# Altium schematic sheet RS-485推荐电路.SchDoc
size A4; Author: 李孟雄; DocumentNumber: 7; SheetNumber: 7; SheetTotal: 27; PageSetup: Record=PageOptions|CenterHorizontal=True|CenterVertical=True|PrintScale=1.00|XCorrection=1.00|YCorrection=1.00|PrintKind=0|BorderSize=5000000|LeftOffset=0|BottomOffset=0|Orientation=2|PaperLength=1000|PaperWidth=1000|Scale=100|PaperSource=7|PrintQuality=600|MediaType=1|DitherType=10|PaperKind=A4|PrintScaleMode=1; DesignDate: 2014-01-15; CheckDate: 2014-01-15; SheetName: RS-485; SheetVersion: V1.00; SheetDescription: RSM485H为自动方向切换模块; productName: i.MX6x评估底板; productModel: iMX6x
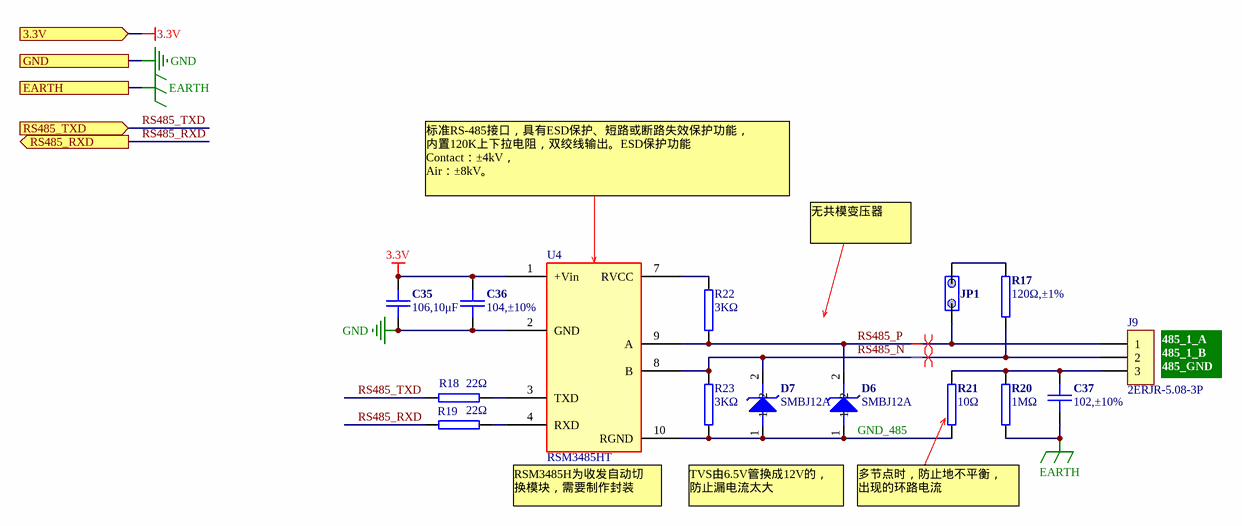
[diagram p0: RS-485推荐电路.SchDoc]

## Parts
C35  106,10μF  [0805C]
C36  104,±10%  [0603C]
C37  102,±10%  [1206C]
D6  value SMBJ12A  [SOD-1812D]  (hidden comment: DIODE ZENER)
D7  value SMBJ12A  [SOD-1812D]  (hidden comment: DIODE ZENER)
J9  value 2ERJR-5.08-3P  [CON-3-5.08]  (hidden comment: CON3)
JP1  120Ω_EN  [SIP-2]  (value not drawn)
R17  120Ω,±1%  [1206R]
R18  22Ω  [0603R]
R19  22Ω  [0603R]
R20  1MΩ  [1206R]
R21  10Ω  [0805R]
R22  3KΩ  [0603R]
R23  3KΩ  [0603R]
U4  RSM3485HT

## Ports
3.3V, EARTH, GND, RS485_RXD (out), RS485_TXD (in)

## Nets
3.3V: C35.1 C36.1 U4.1(+Vin) ; port 3.3V
EARTH: C37.1 R20.2 ; port EARTH
GND: C35.2 C36.2 U4.2(GND) ; port GND
GND_485: D6.1 D7.1 R21.1 R23.2 U4.10(RGND)
RS485_N: D7.2 J9.2 R17.2 R23.1 U4.8(B)
RS485_P: D6.2 J9.1 JP1.1 R22.2 U4.9(A)
RS485_RXD: R19.1 ; port RS485_RXD
RS485_TXD: R18.1 ; port RS485_TXD
NetC37_2: C37.2 J9.3 R20.1 R21.2
NetJP1_2: JP1.2 R17.1
NetR18_2: R18.2 U4.3(TXD)
NetR19_2: R19.2 U4.4(RXD)
NetR22_1: R22.1 U4.7(RVCC)

## Layout directives
differential pair: RS485_N, RS485_P

## Notes on the sheet
- 标准RS-485接口，具有ESD保护、短路或断路失效保护功能，
  内置120K上下拉电阻，双绞线输出。ESD保护功能
  Contact：±4kV，
  Air：±8kV。
- 无共模变压器
- (near J9) 485_1_A
  485_1_B
  485_GND
- (near U4) RSM3485H为收发自动切
  换模块，需要制作封装
- TVS由6.5V管换成12V的，
  防止漏电流太大
- 多节点时，防止地不平衡，
  出现的环路电流
- 1
- #
- 修改日期
- 修改内容
- 2
- 3
- 广州致远电子股份有限公司
- 设计人员
- 审核人员
- 设计日期
- 审核日期
- 产品名称
- 图纸名称
- 产品型号
- 图纸描述
- 图纸版本
- A4

## Library data of the parts
C35 = 1.02.02.0055: 106,10μF,±10%,10V,X5R,0805,RoHS; 名称: 电容; 封装: 0805; 设备封装名称: C0805_106_X5R_10V_10%; 贴片和直插: SMT; 物料代码: 1.02.02.0055; Value: 106,10μF; RoHS: RoHS; 型号: 106,10μF,±10%,10V,X5R; ComponentLink1Description: ErpDataInfo; ComponentLink1URL: http://erp.zlgmcu.com/ErpExt/ErpData/ListMateriel.aspx?pkey=1.02.02.0055
C36 = 1.02.01.0032: 104,±10%,50V,X7R,0603,*,RoHS; 名称: 电容; 封装: 0603; 设备封装名称: C0603_104_X7R_50V_10%; 贴片和直插: SMT; 物料代码: 1.02.01.0032; Value: 104,±10%; RoHS: RoHS; 型号: 104,±10%,50V,X7R; ComponentLink1Description: ErpDataInfo; ComponentLink1URL: http://erp.zlgmcu.com/ErpExt/ErpData/ListMateriel.aspx?pkey=1.02.01.0032
C37 = 1.02.03.0003: 102,±10%,2KV,X7R,1206,*,RoHS; 名称: 电容; 封装: 1206; 设备封装名称: C1206_102_X7R_2KV_10%; 贴片和直插: SMT; 物料代码: 1.02.03.0003; Value: 102,±10%; RoHS: RoHS; 型号: 102,±10%,2KV,X7R; ComponentLink1Description: ErpDataInfo; ComponentLink1URL: http://erp.zlgmcu.com/ErpExt/ErpData/ListMateriel.aspx?pkey=1.02.03.0003
D6 D7 = 1.04.03.0007: SMBJ12A,DO-214AA,君耀,RoHS; 名称: TVS管; 设备封装名称: DO-214AA_SMBJ12A; 贴片和直插: SMT; 器件优选方案: 优先选用; 物料代码: 1.04.03.0007; 封装: DO-214AA; 厂商: 君耀; RoHS: RoHS; 型号: SMBJ12A; ComponentLink1Description: ErpDataInfo; ComponentLink1URL: http://erp.zlgmcu.com/ErpExt/ErpData/ListMateriel.aspx?pkey=1.04.03.0007
J9 = 1.10.06.0170: 2ERJR-5.08-3P; 名称: 端子; 贴片和直插: THT; 器件优选方案: 优先选用; 物料代码: 1.10.06.0170; 型号: 2ERJR-5.08-3P; ComponentLink1Description: ErpDataInfo; ComponentLink1URL: http://erp.zlgmcu.com/ErpExt/ErpData/ListMateriel.aspx?pkey=1.10.06.0170
JP1 = JMP2
R17 = 1.01.03.0025: 名称: 电阻; 规格型号: 120Ω,±1%,1206,RoHS; 封装: 1206; 设备封装名称: R1206_120R_1%; 贴片和直插: SMT; 现有库存: 6550; 物料代码: 1.01.03.0025; Value: 120Ω,±1%; RoHS: RoHS; ComponentLink1Description: ErpDataInfo; ComponentLink1URL: http://erp.zlgmcu.com/ErpExt/ErpData/ListMateriel.aspx?pkey=1.01.03.0025
R18 R19 = 1.01.01.0014: 22Ω,0603,*,RoHS; 名称: 电阻; 封装: 0603; 设备封装名称: R0603_22R; 贴片和直插: SMT; 物料代码: 1.01.01.0014; Value: 22Ω; RoHS: RoHS; 型号: 22Ω; ComponentLink1Description: ErpDataInfo; ComponentLink1URL: http://erp.zlgmcu.com/ErpExt/ErpData/ListMateriel.aspx?pkey=1.01.01.0014
R20 = 1.01.03.0019: 1MΩ,1206,RoHS; 名称: 电阻; 封装: 1206; 设备封装名称: R1206_1M; 贴片和直插: SMT; 物料代码: 1.01.03.0019; Value: 1MΩ; RoHS: RoHS; 型号: 1MΩ; ComponentLink1Description: ErpDataInfo; ComponentLink1URL: http://erp.zlgmcu.com/ErpExt/ErpData/ListMateriel.aspx?pkey=1.01.03.0019
R21 = 1.01.02.0008: 10Ω,0805,*,RoHS; 名称: 电阻; 封装: 0805; 设备封装名称: R0805_10R; 贴片和直插: SMT; 物料代码: 1.01.02.0008; Value: 10Ω; RoHS: RoHS; 型号: 10Ω; ComponentLink1Description: ErpDataInfo; ComponentLink1URL: http://erp.zlgmcu.com/ErpExt/ErpData/ListMateriel.aspx?pkey=1.01.02.0008
R22 R23 = 1.01.01.0041: 3KΩ,0603,*,RoHS; 名称: 电阻; 封装: 0603; 设备封装名称: R0603_3K; 贴片和直插: SMT; 物料代码: 1.01.01.0041; Value: 3KΩ; RoHS: RoHS; 型号: 3KΩ; ComponentLink1Description: ErpDataInfo; ComponentLink1URL: http://erp.zlgmcu.com/ErpExt/ErpData/ListMateriel.aspx?pkey=1.01.01.0041
U4 = RSM3485H